# EAGLE schematic TestBench_rev2 (EAGLE 6.3)
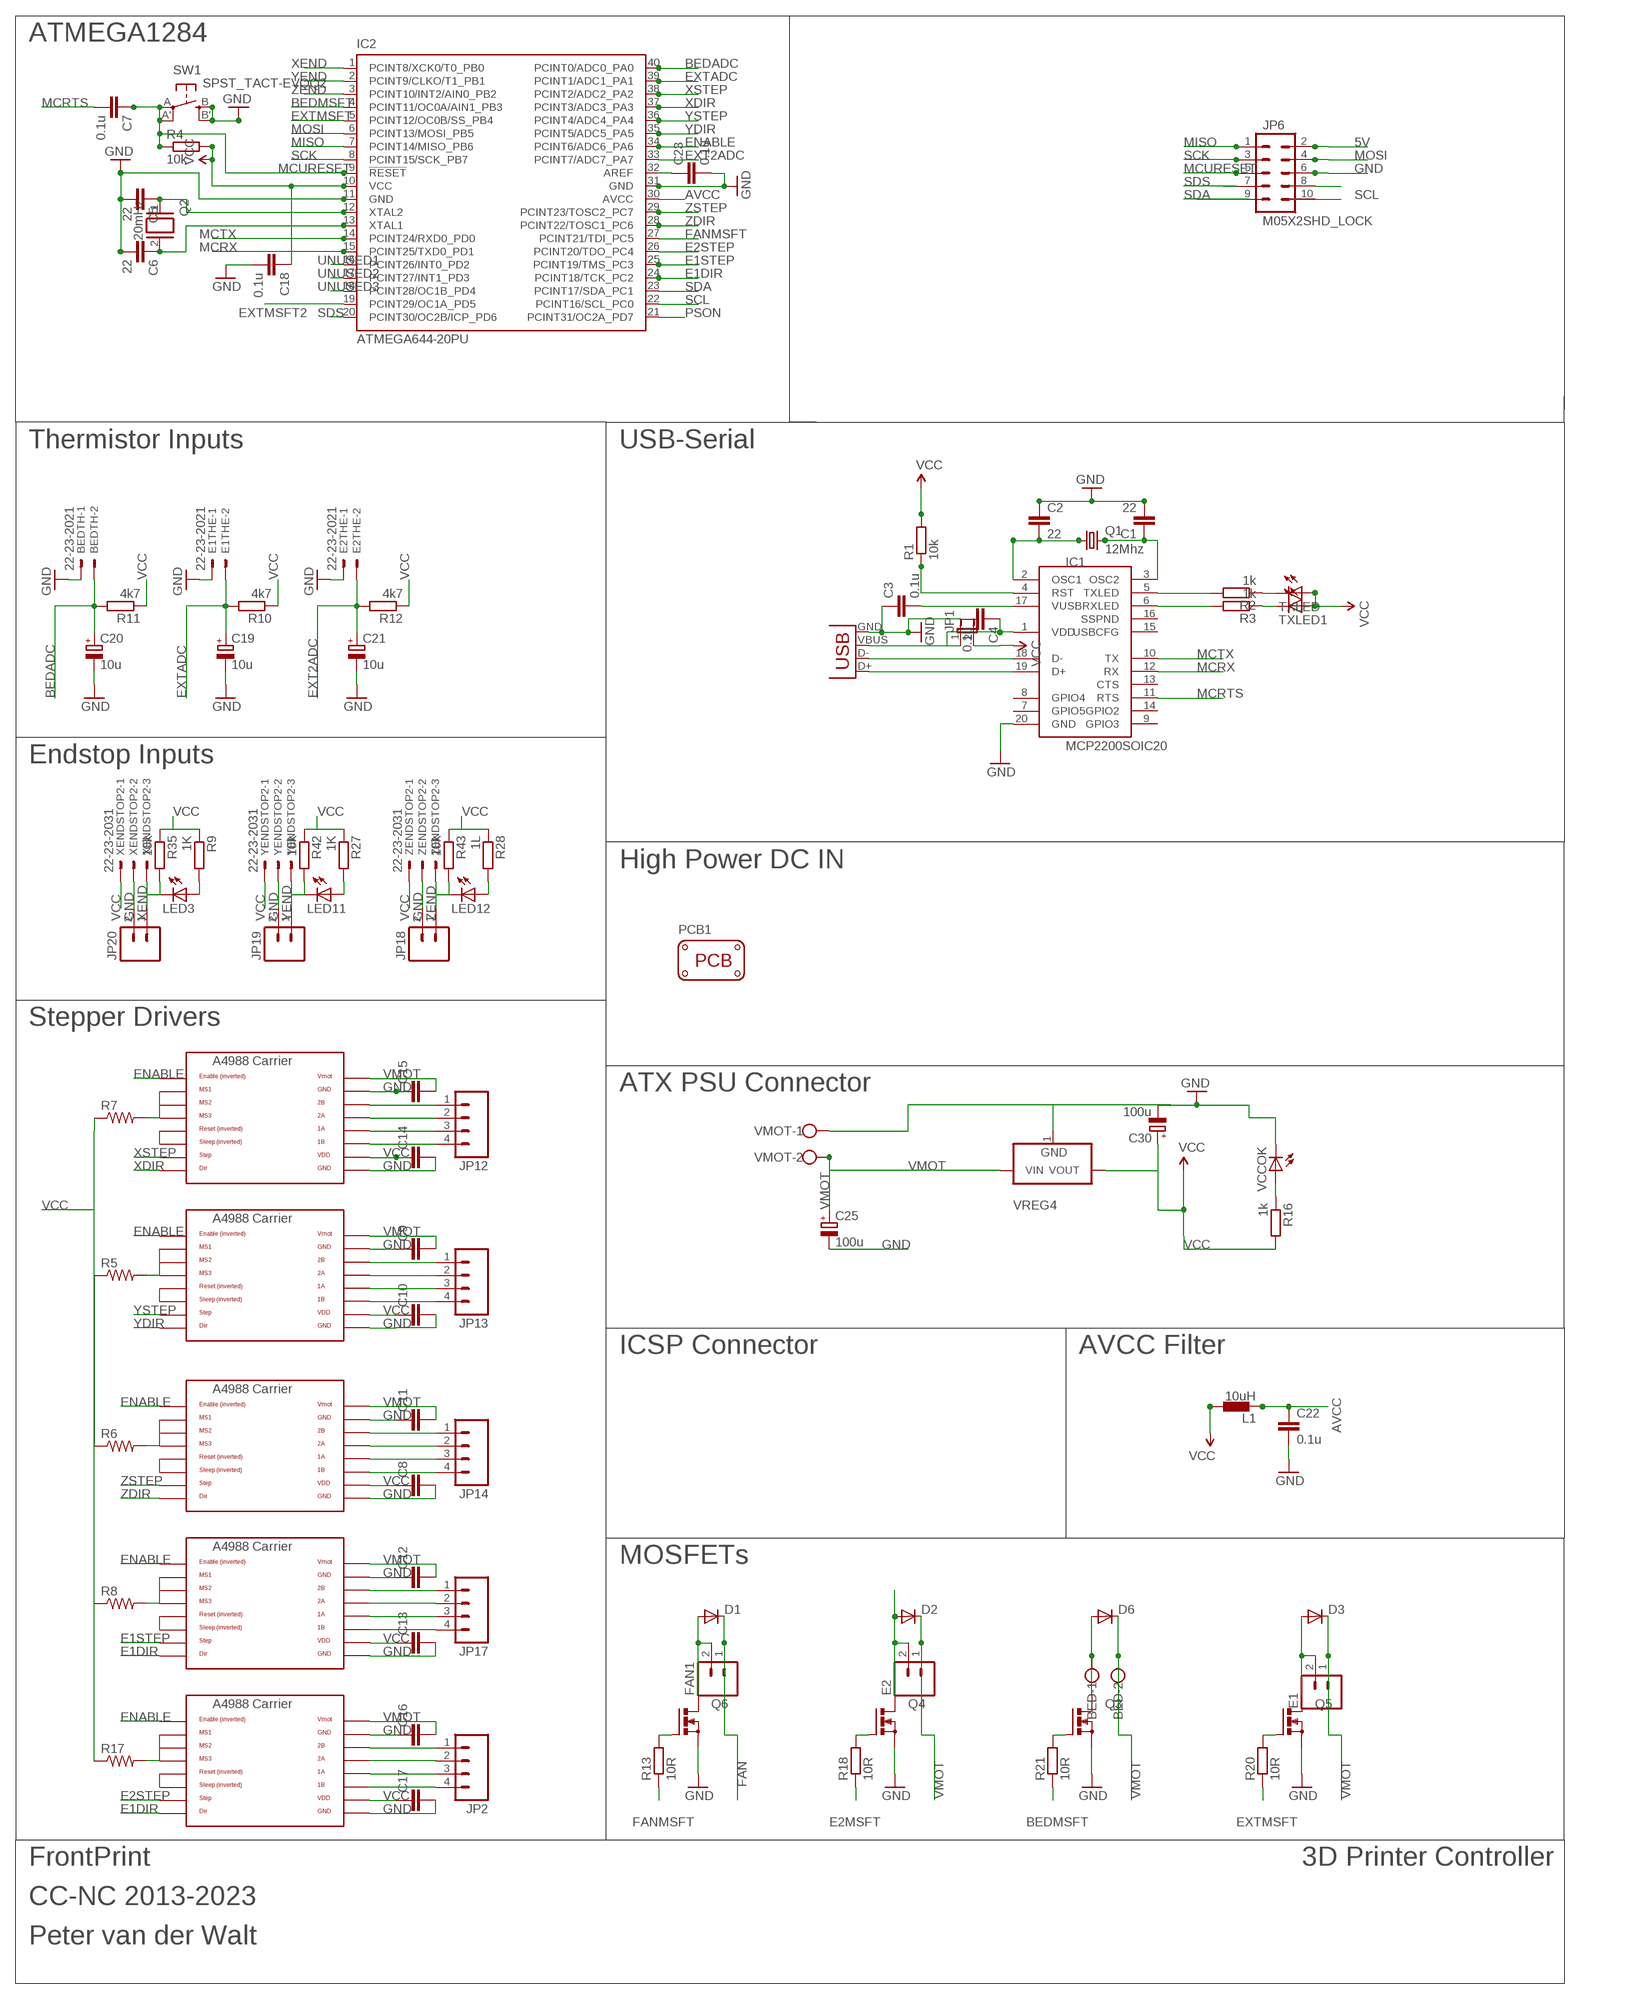
[diagram p0: schematic, sheet 1]

## Parts
BED  W237-102  [W237-102]
BEDTH  22-23-2021  [22-23-2021]
C1  22  CAP1206  [1206]
C2  22  CAP1206  [1206]
C3  0.1u  CAP1206  [1206]
C4  0.1u  CAP1206  [1206]
C5  22  CAP1206  [1206]
C6  22  CAP1206  [1206]
C7  0.1u  CAP1206  [1206]
C8  CAP1206  [1206]
C9  CAP1206  [1206]
C10  CAP1206  [1206]
C11  CAP1206  [1206]
C12  CAP1206  [1206]
C13  CAP1206  [1206]
C14  CAP1206  [1206]
C15  CAP1206  [1206]
C16  CAP1206  [1206]
C17  CAP1206  [1206]
C18  0.1u  CAP1206  [1206]
C19  10u  CPOL-EUE2.5-5  [E2,5-5]
C20  10u  CPOL-EUE2.5-5  [E2,5-5]
C21  10u  CPOL-EUE2.5-5  [E2,5-5]
C22  0.1u  CAP1206  [1206]
C23  0.1u  CAP1206  [1206]
C25  100u  CPOL-EUE5-8.5  [E5-8,5]
C30  100u  CPOL-EUE5-8.5  [E5-8,5]
D1  DIODE1N4148  [DIODE-1N4148]
D2  DIODE1N4148  [DIODE-1N4148]
D3  DIODE1N4148  [DIODE-1N4148]
D6  DIODE1N4148  [DIODE-1N4148]
E1  M023.5MM  [SCREWTERMINAL-3.5MM-2]
E1POL  POLOLU_A4983CARRIER  [A4988BREAKOUT]
E1THE  22-23-2021  [22-23-2021]
E2  M023.5MM  [SCREWTERMINAL-3.5MM-2]
E2POL  POLOLU_A4983CARRIER  [A4988BREAKOUT]
E2THE  22-23-2021  [22-23-2021]
FAN1  M023.5MM  [SCREWTERMINAL-3.5MM-2]
IC1  MCP2200SOIC20  [SOIC20]
IC2  ATMEGA644-20PU  [DIL40]
JP1  JUMPER-2PTH_LOCK  [1X02_LOCK]
JP2  M04SCREW  [SCREWTERMINAL-3.5MM-4]
JP6  M05X2SHD_LOCK  [2X5-SHROUDED_LOCK]
JP12  M04SCREW  [SCREWTERMINAL-3.5MM-4]
JP13  M04SCREW  [SCREWTERMINAL-3.5MM-4]
JP14  M04SCREW  [SCREWTERMINAL-3.5MM-4]
JP17  M04SCREW  [SCREWTERMINAL-3.5MM-4]
JP18  M023.5MM  [SCREWTERMINAL-3.5MM-2]
JP19  M023.5MM  [SCREWTERMINAL-3.5MM-2]
JP20  M023.5MM  [SCREWTERMINAL-3.5MM-2]
L1  10uH  BL01RN1A  [BL01RN1A]
LED3  LEDCHIPLED_1206  [CHIPLED_1206]
LED11  LEDCHIPLED_1206  [CHIPLED_1206]
LED12  LEDCHIPLED_1206  [CHIPLED_1206]
PCB1  PCB_DP_SQUARE-10X10  [DP100100_V1]
Q1  12Mhz  CRYSTALHC49UP  [HC49UP]
Q2  20mHz  XTAL/S  [QS]
Q3  PMOSFET_NTO220BV  [TO220BV]
Q4  PMOSFET_NTO220BV  [TO220BV]
Q5  PMOSFET_NTO220BV  [TO220BV]
Q6  PMOSFET_NTO220BV  [TO220BV]
R1  10k  R-EU_M1206  [M1206]
R2  1k  R-EU_M1206  [M1206]
R3  1k  R-EU_M1206  [M1206]
R4  10k  R-EU_M1206  [M1206]
R5  RESISTOR1206  [1206]
R6  RESISTOR1206  [1206]
R7  RESISTOR1206  [1206]
R8  RESISTOR1206  [1206]
R9  1K  R-EU_M1206  [M1206]
R10  4k7  R-EU_M1206  [M1206]
R11  4k7  R-EU_M1206  [M1206]
R12  4k7  R-EU_M1206  [M1206]
R13  10R  R-EU_M1206  [M1206]
R16  1k  R-EU_M1206  [M1206]
R17  RESISTOR1206  [1206]
R18  10R  R-EU_M1206  [M1206]
R20  10R  R-EU_M1206  [M1206]
R21  10R  R-EU_M1206  [M1206]
R27  1K  R-EU_M1206  [M1206]
R28  1L  R-EU_M1206  [M1206]
R35  10k  R-EU_M1206  [M1206]
R42  10k  R-EU_M1206  [M1206]
R43  10k  R-EU_M1206  [M1206]
SW1  SPST_TACT-EVQQ2  [EVQ-Q2]
TXLED  LEDSMT1206  [1206]
TXLED1  LEDSMT1206  [1206]
VCCOK  LEDSMT1206  [1206]
VMOT  W237-102  [W237-102]
VREG4  VREG_3PINS-DPAK  [DPAK]
X1  USBPTH  [USB-B-PTH]
XENDSTOP2  22-23-2031  [22-23-2031]
XPOL  POLOLU_A4983CARRIER  [A4988BREAKOUT]
YENDSTOP2  22-23-2031  [22-23-2031]
YPOL  POLOLU_A4983CARRIER  [A4988BREAKOUT]
ZENDSTOP2  22-23-2031  [22-23-2031]
ZPOL  POLOLU_A4983CARRIER  [A4988BREAKOUT]

## Nets
5V: JP6.2
AVCC: C22.1 IC2.30(AVCC) L1.1
BEDADC: BEDTH.2 C20.+ IC2.40(PCINT0/ADC0_PA0) R11.2
BEDMSFT: IC2.4(PCINT11/OC0A/AIN1_PB3) R21.1
BEDOUT1: BED.1 D6.A Q3.D
BEDOUT2: D3.A E1.2 Q5.D
E1DIR: E1POL.DIR E2POL.DIR IC2.24(PCINT18/TCK_PC2)
E1OUT1: D2.A E2.2 Q4.D
E1STEP: E1POL.STEP IC2.25(PCINT19/TMS_PC3)
E2MSFT: R18.1
E2STEP: E2POL.STEP IC2.26(PCINT20/TDO_PC4)
ENABLE: E1POL.EN E2POL.EN IC2.34(PCINT6/ADC6_PA6) XPOL.EN YPOL.EN ZPOL.EN
EXT2ADC: C21.+ E2THE.2 IC2.33(PCINT7/ADC7_PA7) R12.2
EXTADC: C19.+ E1THE.2 IC2.39(PCINT1/ADC1_PA1) R10.2
EXTMSFT: IC2.5(PCINT12/OC0B/SS_PB4) R20.1
EXTMSFT2: IC2.19(PCINT29/OC1A_PD5)
FAN: D1.C FAN1.1
FANMSFT: IC2.27(PCINT21/TDI_PC5) R13.1
FANOUT1: D1.A FAN1.2 Q6.D
GND: BEDTH.1 C1.2 C2.1 C3.1 C4.2 C5.2 C6.2 C8.2 C9.1 C10.2 C11.1 C12.1 C13.2 C14.2 C15.1 C16.1 C17.2 C18.2 C19.- C20.- C21.- C22.2 C23.2 C25.- C30.- E1POL.GND E1POL.GND@0(GND) E1THE.1 E2POL.GND E2POL.GND@0(GND) E2THE.1 IC1.20(GND) IC2.11(GND) IC2.31(GND) JP6.6 JP18.2 JP19.2 JP20.2 Q3.S Q4.S Q5.S Q6.S SW1.B'(S1) SW1.B(S) VCCOK.C VMOT.1 VREG4.1(GND) X1.GND XENDSTOP2.2 XPOL.GND XPOL.GND@0(GND) YENDSTOP2.2 YPOL.GND YPOL.GND@0(GND) ZENDSTOP2.2 ZPOL.GND ZPOL.GND@0(GND)
MCRTS: C7.2 IC1.11(RTS)
MCRX: IC1.12(RX) IC2.15(PCINT25/TXD0_PD1)
MCTX: IC1.10(TX) IC2.14(PCINT24/RXD0_PD0)
MCURESET: C7.1 IC2.9(!RESET) JP6.5 R4.1 SW1.A'(P1) SW1.A(P)
MISO: IC2.7(PCINT14/MISO_PB6) JP6.1
MOSI: IC2.6(PCINT13/MOSI_PB5) JP6.4
N$1: C2.2 IC1.2(OSC1) Q1.1
N$2: C1.1 IC1.3(OSC2) Q1.2
N$3: IC1.5(TXLED) R2.2
N$4: IC1.18(D-) X1.D-
N$5: IC1.19(D+) X1.D+
N$6: IC1.6(RXLED) R3.2
N$7: C3.2 IC1.17(VUSB)
N$8: E2POL.RST E2POL.SLP(SLEEP)
N$9: R2.1 TXLED.C
N$10: R3.1 TXLED1.C
N$11: C5.1 IC2.12(XTAL2) Q2.1
N$12: C6.1 IC2.13(XTAL1) Q2.2
N$13: IC1.4(RST) R1.1
N$14: E1POL.RST E1POL.SLP(SLEEP)
N$15: ZPOL.RST ZPOL.SLP(SLEEP)
N$16: YPOL.RST YPOL.SLP(SLEEP)
N$17: XPOL.RST XPOL.SLP(SLEEP)
N$18: R7.2 XPOL.MS1 XPOL.MS2 XPOL.MS3
N$19: R5.2 YPOL.MS1 YPOL.MS2 YPOL.MS3
N$20: E1POL.MS1 E1POL.MS2 E1POL.MS3 R8.2
N$21: R6.2 ZPOL.MS1 ZPOL.MS2 ZPOL.MS3
N$22: E1POL.1B JP17.4
N$23: E1POL.1A JP17.3
N$24: E1POL.2A JP17.2
N$25: E1POL.2B JP17.1
N$26: JP14.4 ZPOL.1B
N$27: JP14.3 ZPOL.1A
N$28: JP14.2 ZPOL.2A
N$29: JP14.1 ZPOL.2B
N$30: JP13.1 YPOL.2B
N$31: JP13.2 YPOL.2A
N$32: JP13.3 YPOL.1A
N$33: JP13.4 YPOL.1B
N$34: JP12.4 XPOL.1B
N$35: JP12.3 XPOL.1A
N$36: JP12.2 XPOL.2A
N$37: JP12.1 XPOL.2B
N$38: LED3.A R9.2
N$39: LED11.A R27.2
N$40: LED12.A R28.2
N$41: E2POL.MS1 E2POL.MS2 E2POL.MS3 R17.2
N$42: E2POL.1B JP2.4
N$43: E2POL.1A JP2.3
N$44: E2POL.2A JP2.2
N$45: E2POL.2B JP2.1
N$46: Q5.G R20.2
N$54: C23.1 IC2.32(AREF)
N$55: Q6.G R13.2
N$58: C4.1 IC1.1(VDD) JP1.1 X1.VBUS
N$61: Q4.G R18.2
N$64: R16.1 VCCOK.A
N$67: Q3.G R21.2
N$73: JP6.8
PSON: IC2.21(PCINT31/OC2A_PD7)
SCK: IC2.8(PCINT15/SCK_PB7) JP6.3
SCL: IC2.22(PCINT16/SCL_PC0) JP6.10
SDA: IC2.23(PCINT17/SDA_PC1) JP6.9
SDS: IC2.20(PCINT30/OC2B/ICP_PD6) JP6.7
UNUSED1: IC2.16(PCINT26/INT0_PD2)
UNUSED2: IC2.17(PCINT27/INT1_PD3)
UNUSED3: IC2.18(PCINT28/OC1B_PD4)
VCC: C8.1 C10.1 C13.1 C14.1 C17.1 C18.1 C30.+ E1POL.VDD E2POL.VDD IC2.10(VCC) JP1.2 L1.2 R1.2 R4.2 R5.1 R6.1 R7.1 R8.1 R9.1 R10.1 R11.1 R12.1 R16.2 R17.1 R27.1 R28.1 R35.1 R42.1 R43.1 TXLED1.A TXLED.A VREG4.2(VOUT) XENDSTOP2.1 XPOL.VDD YENDSTOP2.1 YPOL.VDD ZENDSTOP2.1 ZPOL.VDD
VMOT: BED.2 C9.2 C11.2 C12.2 C15.2 C16.2 C25.+ D2.C D3.C D6.C E1.1 E1POL.VMOT E2.1 E2POL.VMOT VMOT.2 VREG4.3(VIN) XPOL.VMOT YPOL.VMOT ZPOL.VMOT
XDIR: IC2.37(PCINT3/ADC3_PA3) XPOL.DIR
XEND: IC2.1(PCINT8/XCK0/T0_PB0) JP20.1 LED3.C R35.2 XENDSTOP2.3
XSTEP: IC2.38(PCINT2/ADC2_PA2) XPOL.STEP
YDIR: IC2.35(PCINT5/ADC5_PA5) YPOL.DIR
YEND: IC2.2(PCINT9/CLKO/T1_PB1) JP19.1 LED11.C R42.2 YENDSTOP2.3
YSTEP: IC2.36(PCINT4/ADC4_PA4) YPOL.STEP
ZDIR: IC2.28(PCINT22/TOSC1_PC6) ZPOL.DIR
ZEND: IC2.3(PCINT10/INT2/AIN0_PB2) JP18.1 LED12.C R43.2 ZENDSTOP2.3
ZSTEP: IC2.29(PCINT23/TOSC2_PC7) ZPOL.STEP
Unconnected: IC1.7(GPIO5) IC1.8(GPIO4) IC1.9(GPIO3) IC1.13(CTS) IC1.14(GPIO2) IC1.15(USBCFG) IC1.16(SSPND)

## Notes on the sheet
- ATMEGA1284
- Thermistor Inputs | USB-Serial
- Endstop Inputs
- High Power DC IN
- Stepper Drivers
- ATX PSU Connector
- ICSP Connector | AVCC Filter
- MOSFETs
- FrontPrint | 3D Printer Controller
- CC-NC 2013-2023
- Peter van der Walt

## Library data of the parts
BED VMOT = con-wago-500:W237-102: WAGO SCREW CLAMP; MPN: 237-102; OC_FARNELL: unknown; OC_NEWARK: 70K9898
BEDTH E1THE E2THE = con-molex:22-23-2021: .100" (2.54mm) Center Header - 2 Pin; MF: MOLEX; MPN: 22-23-2021; OC_FARNELL: 1462926; OC_NEWARK: 25C3832
C1-C18 C22 C23 = SparkFun-Passives:CAP: Capacitor Standard 0603 ceramic capacitor, and 0.1" leaded capacitor.
C19-C21 C25 C30 = rcl:CPOL-EU: POLARIZED CAPACITOR, European symbol
D1-D3 D6 = SparkFun-DiscreteSemi:DIODE: Diode These are standard reverse protection diodes and small signal diodes. SMA package can handle up to about 1A. SOD-323 can handle about 200mA. What the SOD-323 package when ordering, there are some mfgs out there that are 5-pin packages.
E1 E2 FAN1 JP18-JP20 = SparkFun-Connectors:M02: Header 2 Standard 2-pin 0.1" header. Use with straight break away headers (SKU : PRT-00116), right angle break away headers (PRT-00553), swiss pins (PRT-00743), machine pins (PRT-00117), and female headers (PRT-00115). Molex polarized connector foot print use with SKU : PRT-08233 with associated crimp pins and housings.
E1POL E2POL XPOL YPOL ZPOL = RepRapjr:POLOLU_A4983CARRIER
IC1 = microchip-update-2:MCP2200: USB 2.0 to UART Protocol Converter with GPIO
IC2 = atmel:ATMEGA644-*PU: 8-bit Microcontroller with 64K Bytes In-System Programmable Flash Auto generated by make-symbol-device-package-bsdl.ulp Rev. 34 Source: http://www.atmel.com/dyn/resources/prod_documents/doc2593.pdf; MPN: ATMEGA644-20PU; OC_FARNELL: 1288340; OC_NEWARK: 23M5060
JP1 = SparkFun-Passives:JUMPER-2: Jumper Basic 0.1" spaced jumper. Use with breakaway headers.
JP2 JP12-JP14 JP17 = SparkFun-Connectors:M04: Header 4 Standard 4-pin 0.1" header. Use with straight break away headers (SKU : PRT-00116), right angle break away headers (PRT-00553), swiss pins (PRT-00743), machine pins (PRT-00117), and female headers (PRT-00115). Molex polarized connector foot print use with SKU : PRT-08231 with associated crimp pins and housings. 1MM SMD Version SKU: PRT-10208
JP6 = SparkFun-Connectors:M05X2: Header 5x2 Standard 10-pin dual row 0.1" header. Commonly used with AVR-ISP. Use with Spark Fun Electronics SKU: PRT-00778
L1 = inductors:BL0: Noise Suppression Products/EMI Suppression Filters, Lead EMIFIL(R) Inductor Type Source: http://www.murata.com .. BL01RN1_DS.pdf
LED3 LED11 LED12 TXLED TXLED1 VCCOK = led:LED: LED OSRAM: - CHIPLED LG R971, LG N971, LY N971, LG Q971, LY Q971, LO R971, LY R971 LH N974, LH R974 LS Q976, LO Q976, LY Q976 LO Q996 - Hyper CHIPLED LW Q18S LB Q993, LB Q99A, LB R99A - SideLED LS A670, LO A670, LY A670, LG A670, LP A670 LB A673, LV A673, LT A673, LW A673 LH A674 LY A675 LS A676, LA A676, LO A676, LY A676, LW A676 LS A679, LY A679, LG A679 - Hyper Micro SIDELED® LS Y876, LA Y876, LO Y876, LY Y876 LT Y87S - SmartLED LW L88C, LW L88S LB L89C, LB L89S, LG L890 LS L89K, LO L89K, LY L89K LS L896, LA L896, LO L896, LY L896 - TOPLED LS T670, LO T670, LY T670, LG T670, LP T670 LSG T670, LSP T670, LSY T670, LOP T670, LYG T670 LG T671, LOG T671, LSG T671 LB T673, LV T673, LT T673, LW T673 LH T674 LS T676, LA T676, LO T676, LY T676, LB T676, LH T676, LSB T676, LW T676 LB T67C, LV T67C, LT T67C, LS T67K, LO T67K, LY T67K, LW E67C LS E67B, LA E67B, LO E67B, LY E67B, LB E67C, LV E67C, LT E67C LW T67C LS T679, LY T679, LG T679 LS T770, LO T770, LY T770, LG T770, LP T770 LB T773, LV T773, LT T773, LW T773 LH T774 LS E675, LA E675, LY E675, LS T675 LS T776, LA T776, LO T776, LY T776, LB T776 LHGB T686 LT T68C, LB T68C - Hyper Mini TOPLED® LB M676 - Mini TOPLED Santana® LG M470 LS M47K, LO M47K, LY M47K Source: http://www.osram.convergy.de LUXEON: - LUMILED® LXK2-PW12-R00, LXK2-PW12-S00, LXK2-PW14-U00, LXK2-PW14-V00 LXK2-PM12-R00, LXK2-PM12-S00, LXK2-PM14-U00 LXK2-PE12-Q00, LXK2-PE12-R00, LXK2-PE12-S00, LXK2-PE14-T00, LXK2-PE14-U00 LXK2-PB12-K00, LXK2-PB12-L00, LXK2-PB12-M00, LXK2-PB14-N00, LXK2-PB14-P00, LXK2-PB14-Q00 LXK2-PR12-L00, LXK2-PR12-M00, LXK2-PR14-Q00, LXK2-PR14-R00 LXK2-PD12-Q00, LXK2-PD12-R00, LXK2-PD12-S00 LXK2-PH12-R00, LXK2-PH12-S00 LXK2-PL12-P00, LXK2-PL12-Q00, LXK2-PL12-R00 Source: www.luxeon.com KINGBRIGHT: KA-3528ASYC Source: www.kingbright.com
PCB1 = dp_devices:PCB_DP_SQUARE: Dangerous Prototypes Standard Square PCB sizes
Q1 = adafruit:CRYSTAL: CRYSTAL; OC_FARNELL: unknown; OC_NEWARK: unknown
Q2 = special:XTAL/S: CRYSTAL
Q3-Q6 = transistor-power:PMOSFET_N: Power MOSFET N-Channel
R1-R4 R9-R13 R16 R18 R20 R21 R27 R28 R35 R42 R43 = resistor:R-EU_: RESISTOR, European symbol
R5-R8 R17 = SparkFun-Passives:RESISTOR: Resistor Basic schematic elements and footprints for 0603, 1206, and PTH resistors.
SW1 = adafruit:SPST_TACT: SMT 6mm switch, EVQQ2 series http://www.ladyada.net/library/eagle
VREG4 = dp_devices:VREG_3PINS: Various 3 pin voltage regulators in different packages Double check the right pinout for the right part
X1 = SparkFun-Connectors:USB: USB Connectors USB-B-PTH is fully proven SKU : PRT-00139 USB-miniB is fully proven SKU : PRT-00587 USB-A-PCB is untested. USB-A-H is throughly reviewed, but untested. Spark Fun Electronics SKU : PRT-00437 USB-B-SMT is throughly reviewed, but untested. Needs silkscreen touching up. USB-A-S has not been used/tested USB-MB-H has not been used/tested
XENDSTOP2 YENDSTOP2 ZENDSTOP2 = con-molex:22-23-2031: .100" (2.54mm) Center Header - 3 Pin; MF: MOLEX; MPN: 22-23-2031; OC_FARNELL: 1462950; OC_NEWARK: 30C0862